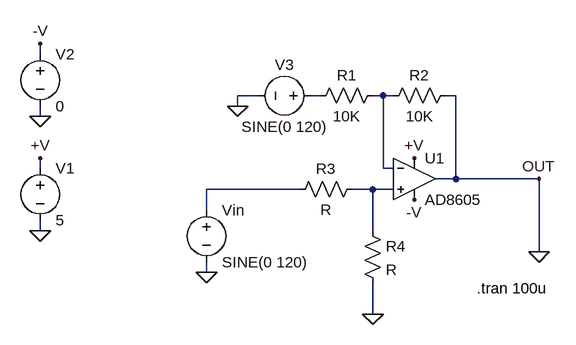
[diagram p0: schematic AD8605.asc]
AD8605.asc, the LTspice schematic file:
Version 4
SHEET 1 1240 700
WIRE 32 -1232 32 -1248
WIRE 368 -1168 336 -1168
WIRE 464 -1168 448 -1168
WIRE 560 -1168 544 -1168
WIRE 576 -1168 560 -1168
WIRE 672 -1168 656 -1168
WIRE 336 -1152 336 -1168
WIRE 32 -1136 32 -1152
WIRE 32 -1056 32 -1072
WIRE 560 -1056 560 -1168
WIRE 576 -1056 560 -1056
WIRE 672 -1040 672 -1168
WIRE 672 -1040 640 -1040
WIRE 800 -1040 672 -1040
WIRE 432 -1024 288 -1024
WIRE 544 -1024 512 -1024
WIRE 576 -1024 544 -1024
WIRE 288 -992 288 -1024
WIRE 32 -960 32 -976
WIRE 544 -960 544 -1024
WIRE 800 -928 800 -1040
WIRE 288 -896 288 -912
WIRE 544 -832 544 -880
FLAG 32 -1072 +V
FLAG 32 -960 0
FLAG 288 -896 0
FLAG 800 -1040 OUT
FLAG 608 -1072 +V
FLAG 32 -1248 -V
FLAG 608 -1008 -V
FLAG 336 -1152 0
FLAG 800 -928 0
FLAG 32 -1136 0
FLAG 544 -832 0
SYMBOL voltage 288 -1008 R0
WINDOW 123 24 44 Left 2
WINDOW 39 24 125 Left 2
SYMATTR InstName Vin
SYMATTR Value SINE(0 120)
SYMBOL Opamps\\AD8605 608 -1104 R0
SYMATTR InstName U1
SYMBOL voltage 32 -1072 R0
WINDOW 123 0 0 Left 2
WINDOW 39 0 0 Left 2
SYMATTR InstName V1
SYMATTR Value 5
SYMBOL res 560 -1184 R90
WINDOW 0 0 56 VBottom 2
WINDOW 3 32 56 VTop 2
SYMATTR InstName R1
SYMATTR Value 10K
SYMBOL res 672 -1184 R90
WINDOW 0 0 56 VBottom 2
WINDOW 3 32 56 VTop 2
SYMATTR InstName R2
SYMATTR Value 10K
SYMBOL voltage 32 -1248 R0
WINDOW 123 24 146 Left 2
WINDOW 39 24 125 Left 2
SYMATTR InstName V2
SYMATTR Value 0
SYMBOL voltage 464 -1168 R90
WINDOW 0 -32 56 VBottom 2
WINDOW 3 32 56 VTop 2
WINDOW 123 0 0 Left 0
WINDOW 39 0 0 Left 0
SYMATTR InstName V3
SYMATTR Value SINE(0 120)
SYMBOL res 528 -1040 R90
WINDOW 0 0 56 VBottom 2
WINDOW 3 32 56 VTop 2
SYMATTR InstName R3
SYMBOL res 528 -976 R0
SYMATTR InstName R4
TEXT 704 -872 Left 2 !.tran 100u

The netlist it stands for:
* AD8605.asc
Vin N003 0 SINE(0 120)
XU1 N004 N002 +V -V 0 AD8605  ; pins In+ In- V+ V- OUT
V1 +V 0 5
R1 N002 N001 10K
R2 0 N002 10K
V2 -V 0 0
V3 N001 0 SINE(0 120)
R3 N004 N003 R
R4 N004 0 R
.tran 100u
.lib ADI.lib
.backanno
.end